# Altium project PC4-SODIMM_V200_RC_A1_20141015.PrjPcb
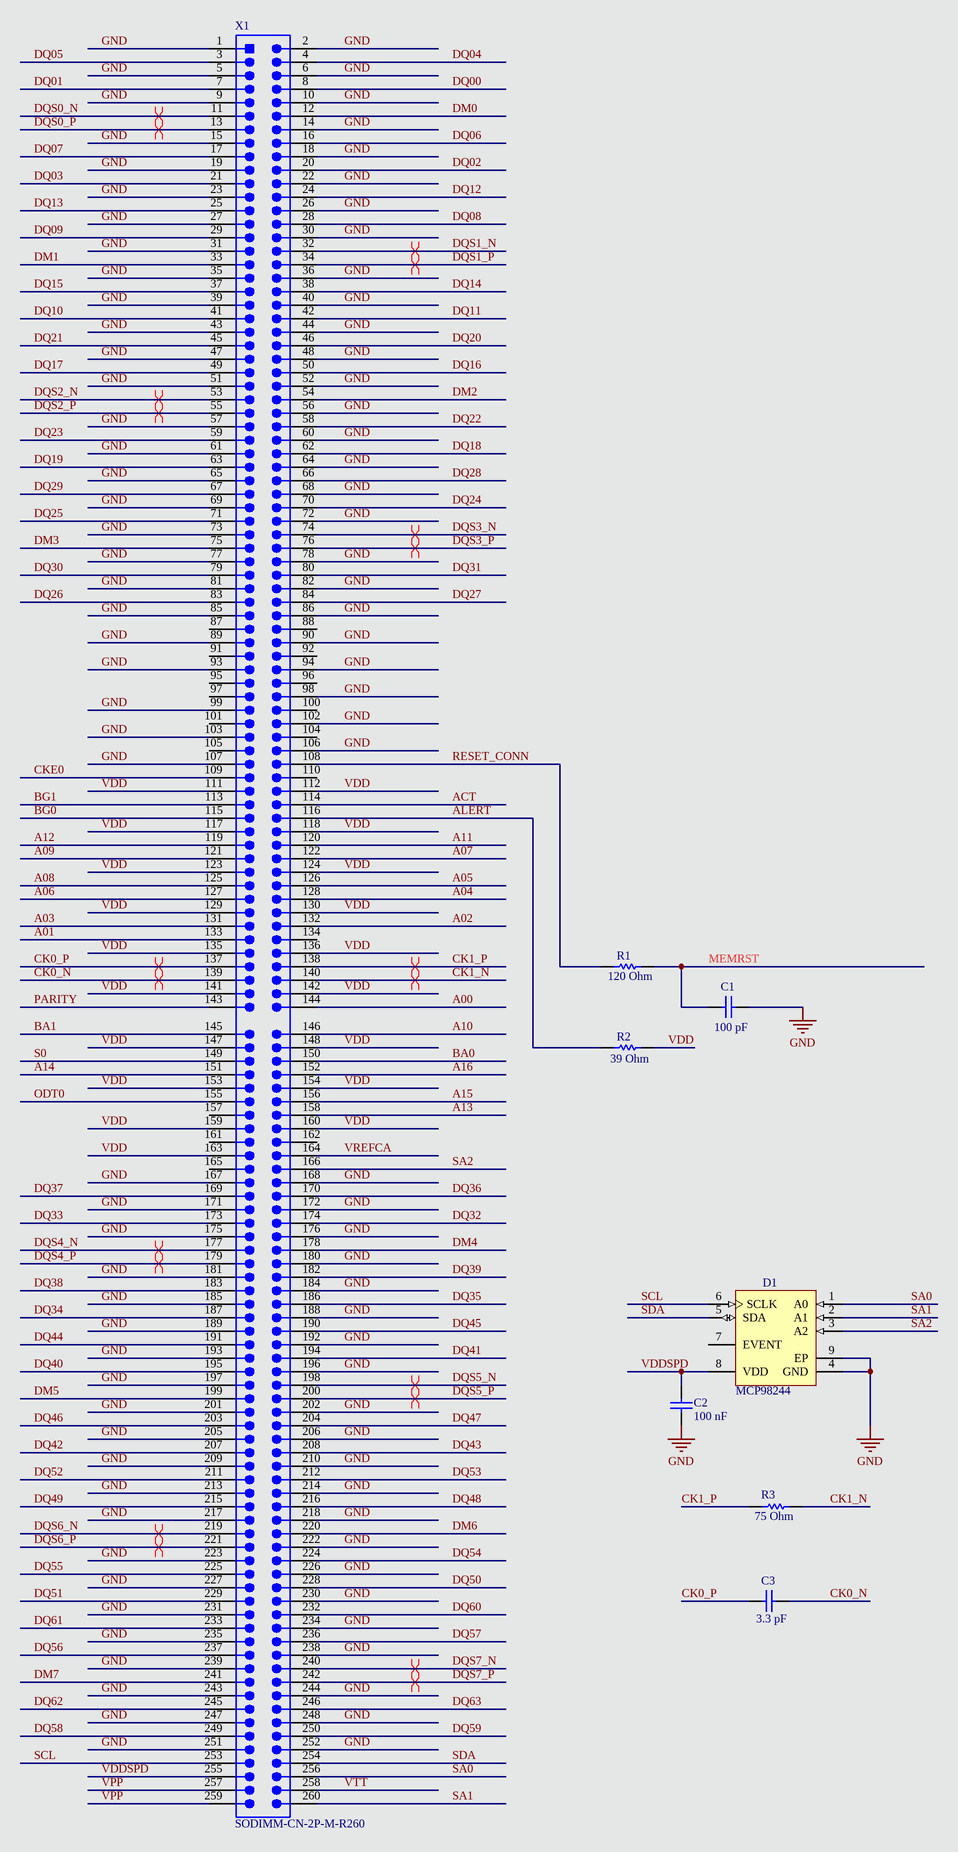
[diagram p0: Sheet1.SchDoc]
CompanyWebsite: www.altium.com; PrjAddress1: 4225 Executive Sqr; PrjAddress2: Suite 700; PrjAddress3: La Jolla, CA, USA; PrjAddress4: 92037; PrjCompanyName: Altium; Project: Mini PC SODIMM
1 sheet, 8 parts. Net scope: global (net labels, ports and power ports of the same name join across sheets).
Board file: PC4-SODIMM_V200_RC_A1_20141015.PcbDoc

## Sheet Sheet1.SchDoc: Connector
size C; DocumentNumber: 1; SheetNumber: 1; SheetTotal: 5

### Parts
C1  Capacitance: 100 pF  [CAPC1005X55X10LL05]  (hidden comment: C1005C0G1H101K050BA)
C2  Capacitance: 100 nF  [CAPC1005X55X10LL05]  (hidden comment: C1005X7R1E104M)
C3  Capacitance: 3.3 pF  [CAPC1005X55X25NL5T10]  (hidden comment: GRM1555C1H3R3CA01D)
D1  MCP98244  [MCHP-TDFN-MNY8_V]
R1  Resistance: 120 Ohm  [RESC1005X40X25ML5T10]  (hidden comment: RC0402JR-07120RL)
R2  Resistance: 39 Ohm  [RESC1005X40X25NL5T10]  (hidden comment: RC0402JR-0739RL)
R3  Resistance: 75 Ohm  [RESC1005X40X25ML05T05]  (hidden comment: ERJ-2GEJ750X)
X1  SODIMM-CN-2P-M-R260  [SODIMM-GF-2D-500-1K-S260]  (no BOM)

### Nets
GND: C1.2 C2.1 D1.4(GND) D1.9(EP) X1.1 X1.2 X1.5 X1.6 X1.9 X1.10 X1.14 X1.15 X1.18 X1.19 X1.22 X1.23 X1.26 X1.27 X1.30 X1.31 X1.35 X1.36 X1.39 X1.40 X1.43 X1.44 X1.47 X1.48 X1.51 X1.52 X1.56 X1.57 X1.60 X1.61 X1.64 X1.65 X1.68 X1.69 X1.72 X1.73 X1.77 X1.78 X1.81 X1.82 X1.85 X1.86 X1.89 X1.90 X1.93 X1.94 X1.98 X1.99 X1.102 X1.103 X1.106 X1.107 X1.167 X1.168 X1.171 X1.172 X1.175 X1.176 X1.180 X1.181 X1.184 X1.185 X1.188 X1.189 X1.192 X1.193 X1.196 X1.197 X1.201 X1.202 X1.205 X1.206 X1.209 X1.210 X1.213 X1.214 X1.217 X1.218 X1.222 X1.223 X1.226 X1.227 X1.230 X1.231 X1.234 X1.235 X1.238 X1.239 X1.243 X1.244 X1.247 X1.248 X1.251 X1.252
A00: X1.144
A01: X1.133
A02: X1.132
A03: X1.131
A04: X1.128
A05: X1.126
A06: X1.127
A07: X1.122
A08: X1.125
A09: X1.121
A10: X1.146
A11: X1.120
A12: X1.119
A13: X1.158
A14: X1.151
A15: X1.156
A16: X1.152
ACT: X1.114
ALERT: R2.1 X1.116
BA0: X1.150
BA1: X1.145
BG0: X1.115
BG1: X1.113
CK0_N: C3.2 X1.139
CK0_P: C3.1 X1.137
CK1_N: R3.2 X1.140
CK1_P: R3.1 X1.138
CKE0: X1.109
DM0: X1.12
DM1: X1.33
DM2: X1.54
DM3: X1.75
DM4: X1.178
DM5: X1.199
DM6: X1.220
DM7: X1.241
DQ00: X1.8
DQ01: X1.7
DQ02: X1.20
DQ03: X1.21
DQ04: X1.4
DQ05: X1.3
DQ06: X1.16
DQ07: X1.17
DQ08: X1.28
DQ09: X1.29
DQ10: X1.41
DQ11: X1.42
DQ12: X1.24
DQ13: X1.25
DQ14: X1.38
DQ15: X1.37
DQ16: X1.50
DQ17: X1.49
DQ18: X1.62
DQ19: X1.63
DQ20: X1.46
DQ21: X1.45
DQ22: X1.58
DQ23: X1.59
DQ24: X1.70
DQ25: X1.71
DQ26: X1.83
DQ27: X1.84
DQ28: X1.66
DQ29: X1.67
DQ30: X1.79
DQ31: X1.80
DQ32: X1.174
DQ33: X1.173
DQ34: X1.187
DQ35: X1.186
DQ36: X1.170
DQ37: X1.169
DQ38: X1.183
DQ39: X1.182
DQ40: X1.195
DQ41: X1.194
DQ42: X1.207
DQ43: X1.208
DQ44: X1.191
DQ45: X1.190
DQ46: X1.203
DQ47: X1.204
DQ48: X1.216
DQ49: X1.215
DQ50: X1.228
DQ51: X1.229
DQ52: X1.211
DQ53: X1.212
DQ54: X1.224
DQ55: X1.225
DQ56: X1.237
DQ57: X1.236
DQ58: X1.249
DQ59: X1.250
DQ60: X1.232
DQ61: X1.233
DQ62: X1.245
DQ63: X1.246
DQS0_N: X1.11
DQS0_P: X1.13
DQS1_N: X1.32
DQS1_P: X1.34
DQS2_N: X1.53
DQS2_P: X1.55
DQS3_N: X1.74
DQS3_P: X1.76
DQS4_N: X1.177
DQS4_P: X1.179
DQS5_N: X1.198
DQS5_P: X1.200
DQS6_N: X1.219
DQS6_P: X1.221
DQS7_N: X1.240
DQS7_P: X1.242
MEMRST: C1.1 R1.2
ODT0: X1.155
PARITY: X1.143
RESET_CONN: R1.1 X1.108
S0: X1.149
SA0: D1.1(A0) X1.256
SA1: D1.2(A1) X1.260
SA2: D1.3(A2) X1.166
SCL: D1.6(SCLK) X1.253
SDA: D1.5(SDA) X1.254
VDD: R2.2 X1.111 X1.112 X1.117 X1.118 X1.123 X1.124 X1.129 X1.130 X1.135 X1.136 X1.141 X1.142 X1.147 X1.148 X1.153 X1.154 X1.159 X1.160 X1.163
VDDSPD: C2.2 D1.8(VDD) X1.255
VPP: X1.257 X1.259
VREFCA: X1.164
VTT: X1.258

Not connected (* = marked no-connect by the designer): D1 7(EVENT); X1 87 88 91 92 95 96 97 100 101 104 105 110 134 157 161 162 165

### Layout directives
differential pair: CK0_N, CK0_P, CK1_N, CK1_P, DQS0_N, DQS0_P, DQS1_N, DQS1_P, DQS2_N, DQS2_P, DQS3_N, DQS3_P, DQS4_N, DQS4_P, DQS5_N, DQS5_P, DQS6_N, DQS6_P, DQS7_N, DQS7_P

### Notes on the sheet
- Title
- Size:
- Date:
- File:
- C
- Number:
- Time:
- Revision:
- Sheet
- of

### Library data of the parts
C1 = CMP-1663-00011-2: Chip Capacitor, 100 pF, +/- 10%, 50 V, -55 to 125 degC, 0402 (1005 Metric), RoHS, Tape and Reel; Voltage Rating: 50 V; ComponentLink2URL: http://datasheet.octopart.com/C-Series-Ceramic-Chip-Capacitors-TDK-datasheet-family-84.pdf; Package Quantity: 10000; DatasheetVersion: 04/2012; Mounting Technology: Surface Mount; ComponentLink1Description: Manufacturer URL; Packaging: Tape and Reel; Tolerance: 10%; Max Operating Temperature: 125 degC; RoHSCompliant: true; ComponentLink1URL: http://www.tdk.com/; Min Operating Temperature: -55 degC; PackageDescription: 2-Pin Surface Mount Device, Body 1 x 0.5 mm; Case/Package: 0402; Mount: Surface Mount; PartNumber: C1005C0G1H101K050BA; ComponentLink2Description: Datasheet
C2 = CMP-1663-00009-2: Chip Capacitor, 0.1 uF, +/- 20%, 25 V, -55 to 125 degC, 0402 (1005 Metric), RoHS, Tape and Reel; Voltage Rating: 25 V; Type (Capacitors): X7R; Case\/Package: 0402; PackageReference: 0402; Tolerance: 20%; Height: 0.5 mm; Package Quantity: 10000; Mounting Technology: Surface Mount; Width: 0.5 mm; Packaging: Tape and Reel; Case Code (Metric): 1005; Pins: 2; Voltage Rating (DC): 25 V; ComponentLink2URL: http://www.farnell.com/datasheets/1571323.pdf; ComponentLink1URL: http://www.tdk.com/; PackageDescription: 2-Pin Surface Mount Device, Body 1 x 0.5 mm; Max Operating Temperature: 125 degC; ComponentLink2Description: Datasheet; PartNumber: C1005X7R1E104M; Mount: Surface Mount; RoHSCompliant: true; ComponentLink1Description: Manufacturer URL; Min Operating Temperature: -55 degC; Length: 1 mm; Case Code (Imperial): 0402; DatasheetVersion: 09/2011
C3 = CMP-2008-04352-2: Chip Capacitor, 3.3 pF, +/- 0.25 pF, 50 V, -55 to 125 degC, 0402 (1005 Metric), RoHS, Tape and Reel; Type (Capacitors): C0G; Voltage Rating: 50 V; PartNumber: GRM1555C1H3R3CA01D; Package Quantity: 10000; Mounting Technology: Surface Mount; Case Code (Metric): 1005; ComponentLink1Description: Manufacturer URL; PackageDescription: 2-Pin Surface Mount Device, Body 1 x 0.5 mm; Length: 0.039 inch; RoHSCompliant: true; ComponentLink1URL: http://www.murata.com/; Height: 0.5 mm; Max Operating Temperature: 125 degC; REACH SVHC: No SVHC; ComponentLink2URL: http://search.murata.co.jp/Ceramy/image/img/A01X/G101/ENG/GRM1555C1H3R3CA01-01.pdf; Width: 0.02 inch; Mount: Surface Mount; Min Operating Temperature: -55 degC; Case Code (Imperial): 0402; Case/Package: 0402; Radiation Hardening: No; Voltage Rating (DC): 50 V; ComponentLink2Description: Datasheet; Packaging: Tape and Reel; DatasheetVersion: 03/2016
D1 = CMP-1721-00006-1: DDR4 DIMM Temperature Sensor with EEPROM for SPD, 1.7 to 3.6 V, -65 to 150 degC, 8-PinTDFN, Pb-free, Tape and Reel; PackageDescription: 8-Pin Thin Dual Flat No-lead Package, Body 2 x 3 mm, Pitch 0.5 mm; Mounting Technology: Surface Mount; ComponentLink1Description: Manufacturer URL; ComponentLink2Description: Datasheet; ComponentLink2URL: http://ww1.microchip.com/downloads/en/DeviceDoc/22327C.pdf; PartNumber: MCP98244; DatasheetVersion: Rev. C, 05/2013; ComponentLink1URL: http://www.microchip.com/
R1 = CMP-2002-07920-2: Chip Resistor, 120 Ohm, +/- 5%, 0.063 W, -55 to 155 degC, 0402 (1005 Metric), RoHS, Tape and Reel; Voltage Rating: 50 V; Type (Resistor): Thick Film; Power Rating: 63 mW; Packaging: Tape and Reel; Tolerance: 5%; Case/Package: 0402; Min Operating Temperature: -55 degC; DatasheetVersion: Rev. 4, 02/2016; Pins: 2; Width: 0.5 mm; Mount: Surface Mount; ComponentLink1Description: Manufacturer URL; Package Quantity: 10000; Max Operating Temperature: 155 degC; Case Code (Metric): 1005; PackageDescription: 2-Pin Surface Mount Device, Body 1 x 0.5 mm; Height: 0.35 mm; Mounting Technology: Surface Mount; ComponentLink1URL: http://www.yageo.com/; ComponentLink2URL: http://www.yageo.com/documents/recent/PYu-RC_Group_51_RoHS_L_04.pdf; RoHSCompliant: true; Case Code (Imperial): 0402; Voltage Rating (DC): 50 V; REACH SVHC: No SVHC; ComponentLink2Description: Datasheet; Length: 1 mm; PartNumber: RC0402JR-07120RL
R2 = CMP-2002-07994-2: Chip Resistor, 39 Ohm, +/- 5%, 0.063 W, -55 to 155 degC, 0402 (1005 Metric), RoHS, Tape and Reel; Power Rating: 63 mW; Voltage Rating (DC): 50 V; Case Code (Imperial): 0402; Mount: Surface Mount; Max Operating Temperature: 155 degC; Case Code (Metric): 1005; ComponentLink1Description: Manufacturer URL; PackageDescription: 2-Pin Surface Mount Device, Body 1 x 0.5 mm; PartNumber: RC0402JR-0739RL; ComponentLink2Description: Datasheet; Tolerance: 5%; Height: 0.35 mm; Pins: 2; Min Operating Temperature: -55 degC; Length: 1 mm; DatasheetVersion: Rev. 4, 02/2016; ComponentLink2URL: http://www.yageo.com/documents/recent/PYu-RC_Group_51_RoHS_L_04.pdf; Mounting Technology: Surface Mount; Packaging: Cut Tape; Case/Package: 0402; Package Quantity: 1; RoHSCompliant: true; REACH SVHC: No SVHC; Width: 0.5 mm; Voltage Rating: 50 V; ComponentLink1URL: http://www.yageo.com/
R3 = CMP-2002-00578-3: Chip Resistor, 75 Ohm, +/- 5%, 100 mW, -55 to 155 degC, 0402 (1005 Metric), RoHS, Tape and Reel; Manufacturer: Basic Passives; Power Rating: 100 mW; Voltage Rating: 50 V; Case\/Package: 0402; Height: 0.35 mm; PackageReference: 0402; Package Quantity: 10000; Mounting Technology: Surface Mount; Tolerance: 5%; Length: 1 mm; ComponentLink2URL: http://industrial.panasonic.com/cdbs/www-data/pdf/RDA0000/AOA0000C84.pdf; Mount: Surface Mount; DatasheetVersion: 03/2015; RoHSCompliant: true; PartNumber: ERJ-2GEJ750X; Max Operating Temperature: 155 degC; REACH SVHC: Unknown; ComponentLink2Description: Datasheet; Case Code (Imperial): 0402; ComponentLink1URL: http://www.panasonic.com/; PackageDescription: 2-Pin Surface Mount Device, Body 1 x 0.5 mm; Radiation Hardening: No; Width: 0.5 mm; Pins: 2; ComponentLink1Description: Manufacturer URL; Packaging: Tape and Reel; Min Operating Temperature: -55 degC; Case Code (Metric): 1005
X1 = CMP-0001-00005-1: Golden finger, SODIMM, Dual, Staggered, Pitch 0.5mm, 260-Position; Class Name: Edge Connector; Mating Connector: AS0A823-H4SB-7H; System: Connector; Package Reference: SODIMM-GF-2D-500-1K-S260; Publisher: Altium